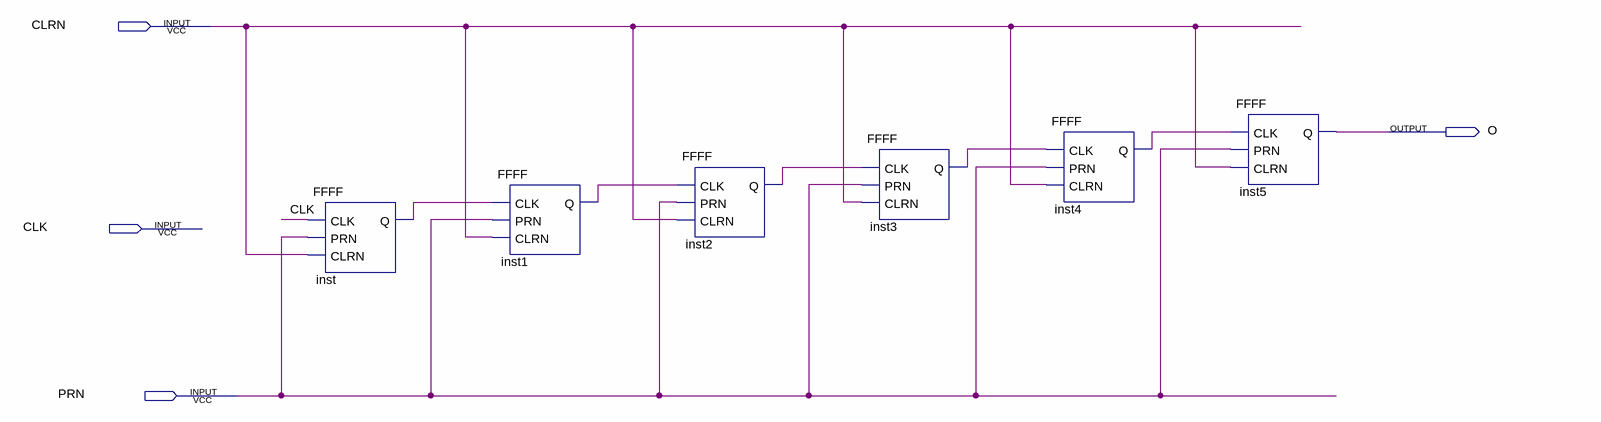
[diagram p0: schematic sheet]
// Quartus schematic lab7.bdf as structural Verilog: 6 symbols, 4 pins
module lab7 (
  input  CLRN,
  input  CLK,
  input  PRN,
  output O
);

  wire inst1_q, inst2_q, inst3_q, inst4_q, inst_q;

  FFFF inst (.CLK(CLK), .PRN(PRN), .CLRN(CLRN), .Q(inst_q));
  FFFF inst1 (.CLK(inst_q), .PRN(PRN), .CLRN(CLRN), .Q(inst1_q));
  FFFF inst2 (.CLK(inst1_q), .PRN(PRN), .CLRN(CLRN), .Q(inst2_q));
  FFFF inst3 (.CLK(inst2_q), .PRN(PRN), .CLRN(CLRN), .Q(inst3_q));
  FFFF inst4 (.CLK(inst3_q), .PRN(PRN), .CLRN(CLRN), .Q(inst4_q));
  FFFF inst5 (.CLK(inst4_q), .PRN(PRN), .CLRN(CLRN), .Q(O));
endmodule
